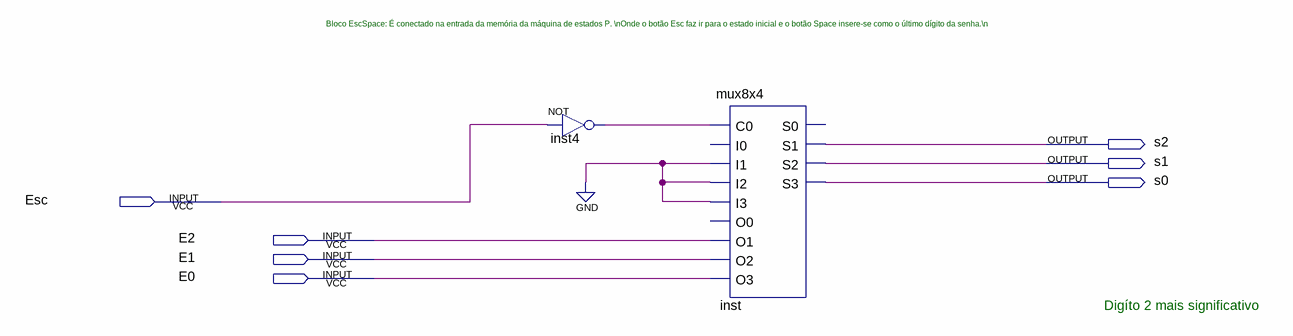
[diagram p0: schematic sheet]
// Quartus schematic Esc.bdf as structural Verilog: 2 symbols, 7 pins
module Esc (
  input  Esc,
  input  E2,
  input  E1,
  input  E0,
  output s2,
  output s1,
  output s0
);

  wire inst4_out;

  not inst4 (inst4_out, Esc);
  mux8x4 inst (
    .C0(inst4_out), .I1(1'b0), .I2(1'b0), .I3(1'b0), .O1(E2), .O2(E1), .O3(E0), .S1(s2), .S2(s1), .S3(s0));  // open: I0, O0, S0

  // Notes on the sheet:
  //   Bloco EscSpace: É conectado na entrada da memória da máquina de estados P. \nOnde o botão Esc faz ir para o estado inicial e o botão Space insere-se como o último dígito da senha.\n
  //   Digíto 2 mais significativo
endmodule
